# Altium schematic sheet LDO.SchDoc
size A4; SheetNumber: 5; SheetTotal: 8
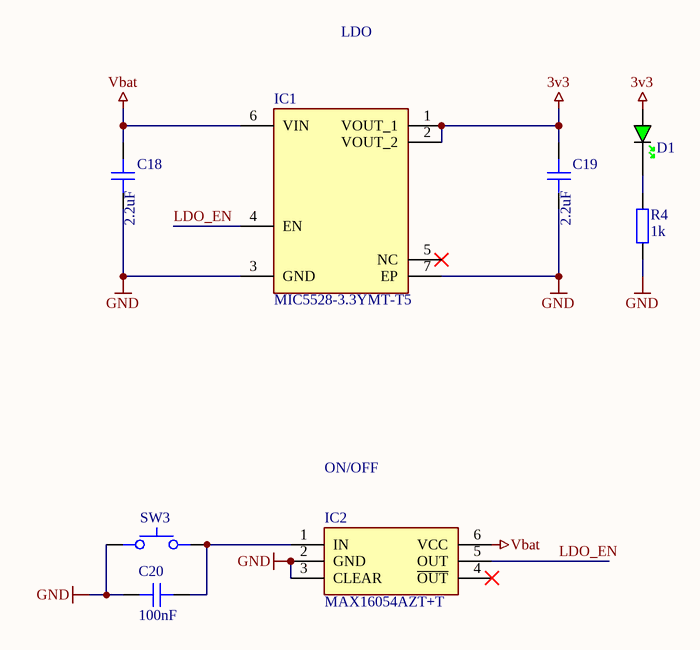
[diagram p0: LDO.SchDoc]

## Parts
C18  value 2.2uF  [CAP_0402]  (hidden comment: C0402_10V)
C19  value 2.2uF  [CAP_0402]  (hidden comment: C0402_10V)
C20  value 100nF  [CAP_0402]  (hidden comment: C0402_10V)
D1  GREEN  [LED_0402_GREEN]  (value not drawn)
IC1  MIC5528-3.3YMT-T5  [SON40P120X120X60-7N-D]
IC2  MAX16054AZT+T  [SOT95P275X110-6N]
R4  value 1k  [RES_0402]  (hidden comment: R0402)
SW3  SKRPANE010  [SKRPANE010]  (value not drawn)

## Nets
3v3: C19.2 D1.A IC1.1(VOUT_1) IC1.2(VOUT_2)
GND: C18.1 C19.1 C20.2 IC1.3(GND) IC1.7(EP) IC2.2(GND) IC2.3(CLEAR) R4.2 SW3.12
Vbat: C18.2 IC1.6(VIN) IC2.6(VCC)
LDO_EN: IC1.4(EN) IC2.5(OUT)
NetC20_1: C20.1 IC2.1(IN) SW3.34
NetD1_K: D1.K R4.1

Not connected (* = marked no-connect by the designer): IC1 5(NC)*; IC2 4(~{OUT})*

## Notes on the sheet
- LDO
- ON/OFF

## Library data of the parts
C18-C20 = CAP_0402_10V: Capacitor SMD 0402 10V
D1 = LED_0402_GREEN: LED 0402 GREEN SMD
IC1 = MIC5528-3.3YMT-T5: LDO 3v3 500mA; Manufacturer_Name: Microchip; Datasheet Link: https://nl.mouser.com/datasheet/2/268/MIC5528_High_Performance_500mA_LDO_in_Thin_and_Ext-1891284.pdf; Height: 0.6mm; Manufacturer_Part_Number: MIC5528-3.3YMT-T5; Mouser Part Number: 998-MIC5528-3.3YMTT5; Mouser Price/Stock: https://www.mouser.co.uk/ProductDetail/Microchip-Technology/MIC5528-3.3YMT-T5?qs=U6T8BxXiZAUrsVLummtswg%3D%3D; Arrow Part Number: MIC5528-3.3YMT-T5; Arrow Price/Stock: https://www.arrow.com/en/products/mic5528-3.3ymt-t5/microchip-technology?region=nac
IC2 = MAX16054AZT+T: Integrated Circuit; Manufacturer_Name: Analog Devices; Datasheet Link: https://datasheet.datasheetarchive.com/originals/distributors/SFDatasheet-4/sf-00087822.pdf; Height: 1.1mm; Manufacturer_Part_Number: MAX16054AZT+T; Mouser Part Number: 700-MAX16054AZTT; Mouser Price/Stock: https://www.mouser.co.uk/ProductDetail/Analog-Devices-Maxim-Integrated/MAX16054AZT%2bT?qs=CDqwynd4ZNoG75aAAjGoqQ%3D%3D; Arrow Part Number: MAX16054AZT+T; Arrow Price/Stock: https://www.arrow.com/en/products/max16054aztt/maxim-integrated?region=nac
R4 = RES_0402: Resistor SMD 0402; Manufacturer: *; Manufacturer Part Number: *; Distributor Link: *
SW3 = SKRPANE010: Tactile Switch SMD SPST; Manufacturer: Alps Alpine; Manufacturer Part Number: SKRPANE010